# EAGLE design Volt Shield v1 (EAGLE 5.11)

## Sheet 1 of 3
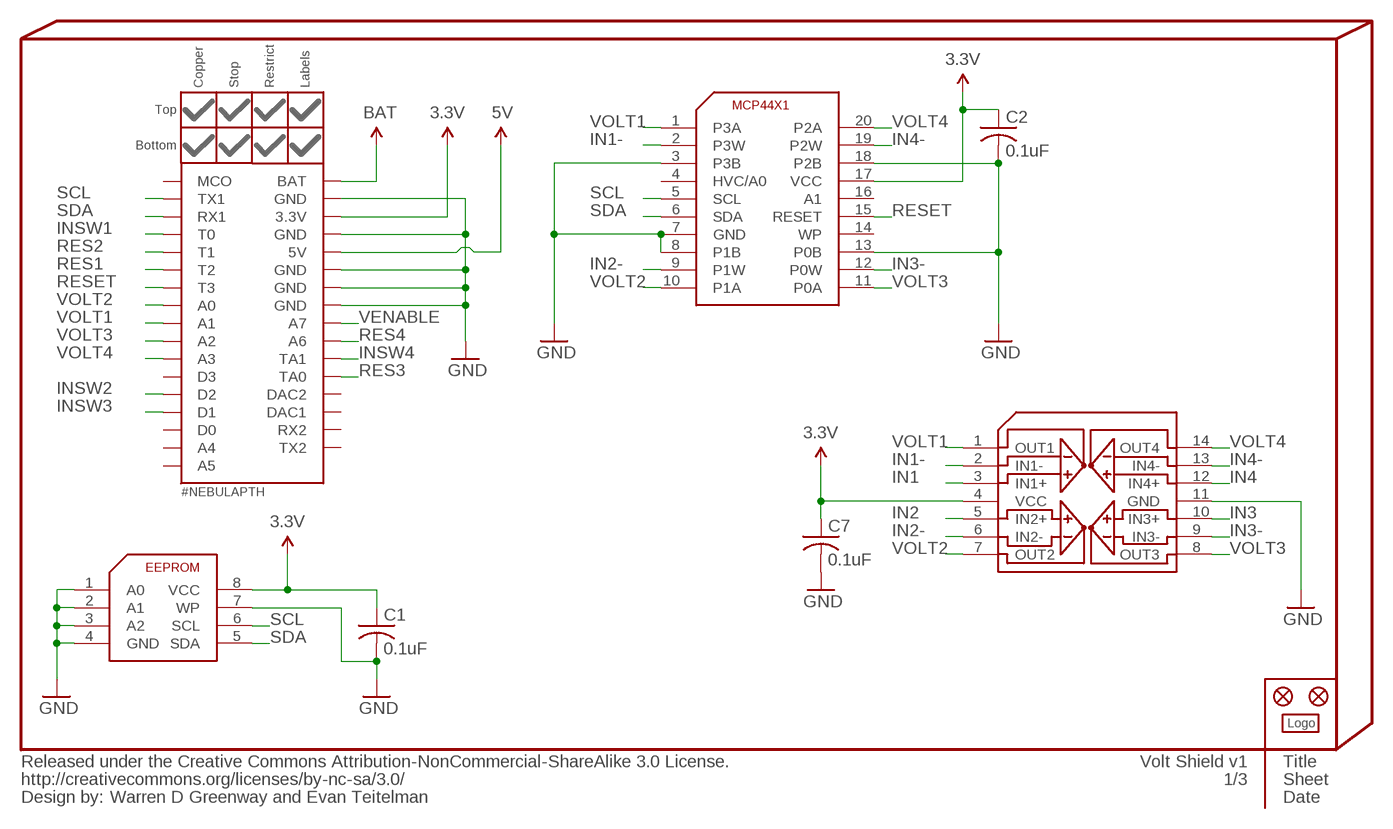
[diagram p0: schematic, sheet 1]

### Parts
C1  0.1uF  C-USC0402  [C0402]
C2  0.1uF  C-USC0402  [C0402]
C7  0.1uF  C-USC0402  [C0402]
INFO2  Warren D Greenway and Evan Teitelman  %CC-NC-SA  [%CC-NC-SA]
JP5  FIDUCIAL1X2  [FIDUCIAL-1X2]
JP6  FIDUCIAL1X2  [FIDUCIAL-1X2]
LOGO1  #PYGMYLOGONORMAL  #PYGMYLOGOLARGE  [#PYGMYLOGO]
NEBULA1  #NEBULAPTH  [#NEBULA-PTH]
NEBULAPART1  #NEBULA-PARTRESTRICT  [#NEBULA-RESTRICT]
NEBULAPART2  #NEBULA-PARTLABELS-TOP  [#NEBULA-LABELS-TOP]
NEBULAPART3  #NEBULA-PARTCOPPER  [#NEBULA-COPPER]
NEBULAPART4  #NEBULA-PARTSTOP  [#NEBULA-STOP]
U2  DIGIPOT-MCP44X1  [TSSOP20]
U3  EEPROM-ATMEL-AT24HC02B  [TSSOP8]
U8  OPAMP-ST-LMV324ID  [SO-14]

### Nets
3.3V: C1.1 C2.1 C7.1 NEBULA1.3.3V U2.17(VCC) U3.8(VCC) U8.4(VCC) ; supply symbol labelled @3.3V ; also sheet 2
5V: NEBULA1.5V ; supply symbol labelled @5V
BAT: NEBULA1.BAT ; supply symbol labelled @BAT ; also sheet 3
GND: C1.2 C2.2 C7.2 NEBULA1.GND1(GND) NEBULA1.GND2(GND) NEBULA1.GND3(GND) NEBULA1.GND4(GND) NEBULA1.GND5(GND) U2.3(P3B) U2.7(GND) U2.8(P1B) U2.13(P0B) U2.18(P2B) U3.1(A0) U3.2(A1) U3.3(A2) U3.4(GND) U3.7(WP) U8.11(GND) ; supply symbol labelled @GND ; also sheet 2,3
IN1: U8.3(IN1+) ; also sheet 2
IN1-: U2.2(P3W) U8.2(IN1-)
IN2: U8.5(IN2+) ; also sheet 2
IN2-: U2.9(P1W) U8.6(IN2-)
IN3: U8.10(IN3+) ; also sheet 2
IN3-: U2.12(P0W) U8.9(IN3-)
IN4: U8.12(IN4+) ; also sheet 2
IN4-: U2.19(P2W) U8.13(IN4-)
INSW1: NEBULA1.T0 ; also sheet 2
INSW2: NEBULA1.D2 ; also sheet 2
INSW3: NEBULA1.D1 ; also sheet 2
INSW4: NEBULA1.TA1 ; also sheet 2
RES1: NEBULA1.T2 ; also sheet 2
RES2: NEBULA1.T1 ; also sheet 2
RES3: NEBULA1.TA0 ; also sheet 2
RES4: NEBULA1.A6 ; also sheet 2
RESET: NEBULA1.T3 U2.15(RESET)
SCL: NEBULA1.COM1_TX(TX1) U2.5(SCL) U3.6(SCL)
SDA: NEBULA1.COM1_RX(RX1) U2.6(SDA) U3.5(SDA)
VENABLE: NEBULA1.A7 ; also sheet 3
VOLT1: NEBULA1.A1 U2.1(P3A) U8.1(OUT1)
VOLT2: NEBULA1.A0 U2.10(P1A) U8.7(OUT2)
VOLT3: NEBULA1.A2 U2.11(P0A) U8.8(OUT3)
VOLT4: NEBULA1.A3 U2.20(P2A) U8.14(OUT4)
Unconnected: NEBULA1.A4 NEBULA1.A5 NEBULA1.COM2_RX(RX2) NEBULA1.COM2_TX(TX2) NEBULA1.D0 NEBULA1.D3 NEBULA1.DAC1 NEBULA1.DAC2 NEBULA1.MCO U2.4(HVC/A0) U2.14(WP) U2.16(A1)

## Sheet 2 of 3
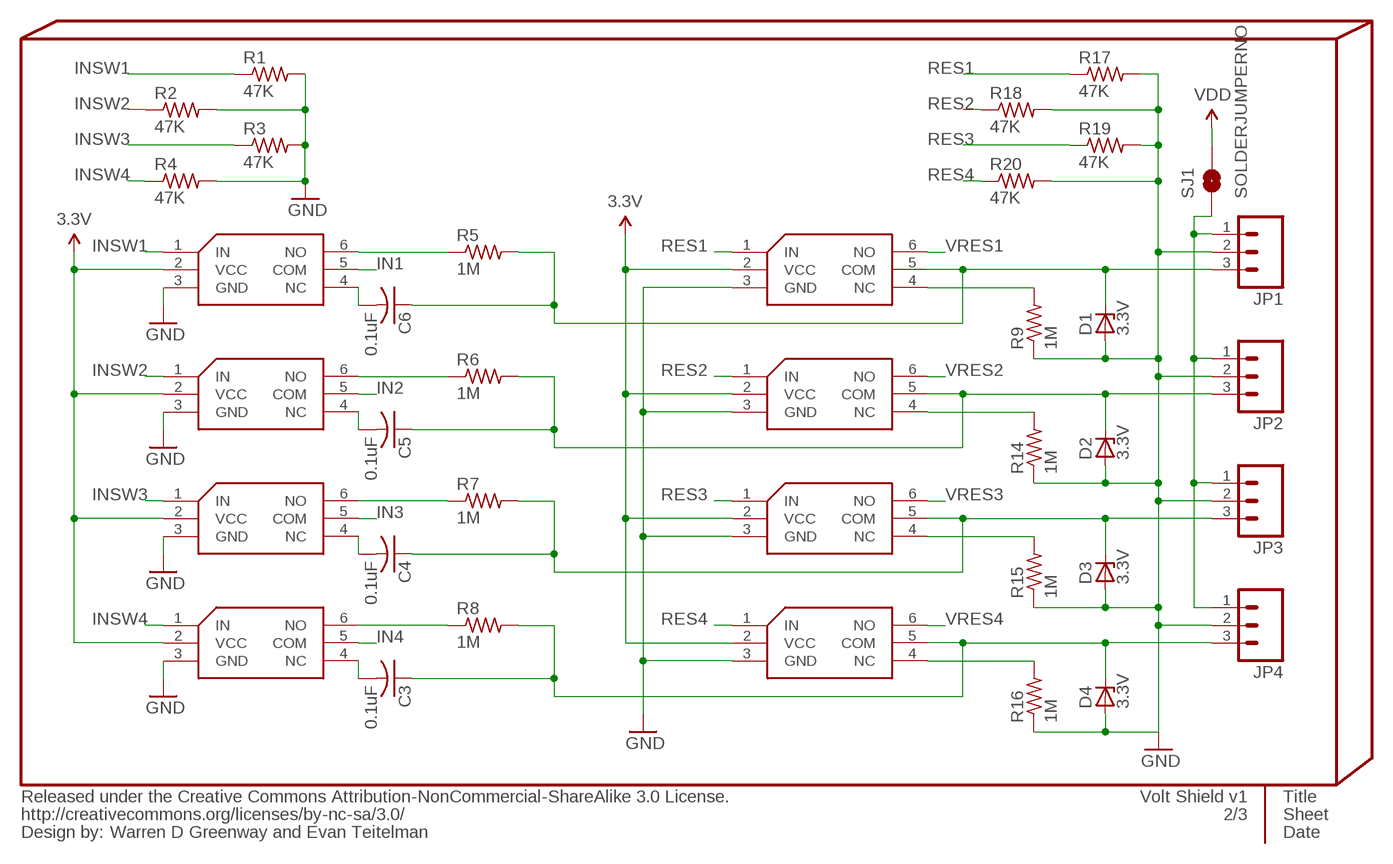
[diagram p1: schematic, sheet 2]

### Parts
C3  0.1uF  C-USC0402  [C0402]
C4  0.1uF  C-USC0402  [C0402]
C5  0.1uF  C-USC0402  [C0402]
C6  0.1uF  C-USC0402  [C0402]
D1  3.3V  ZENER-DIODESOD80C  [SOD80C]
D2  3.3V  ZENER-DIODESOD80C  [SOD80C]
D3  3.3V  ZENER-DIODESOD80C  [SOD80C]
D4  3.3V  ZENER-DIODESOD80C  [SOD80C]
JP1  M03JST-PTH  [JST-3-PTH]
JP2  M03JST-PTH  [JST-3-PTH]
JP3  M03JST-PTH  [JST-3-PTH]
JP4  M03JST-PTH  [JST-3-PTH]
R1  47K  R-US_R0402  [R0402]
R2  47K  R-US_R0402  [R0402]
R3  47K  R-US_R0402  [R0402]
R4  47K  R-US_R0402  [R0402]
R5  1M  R-US_R0402  [R0402]
R6  1M  R-US_R0402  [R0402]
R7  1M  R-US_R0402  [R0402]
R8  1M  R-US_R0402  [R0402]
R9  1M  R-US_R0402  [R0402]
R14  1M  R-US_R0402  [R0402]
R15  1M  R-US_R0402  [R0402]
R16  1M  R-US_R0402  [R0402]
R17  47K  R-US_R0402  [R0402]
R18  47K  R-US_R0402  [R0402]
R19  47K  R-US_R0402  [R0402]
R20  47K  R-US_R0402  [R0402]
SJ1  SOLDERJUMPERNO  [SJ_2S-NO]
U4  MULTIPLEXER-TI-TS5A4624  [SC70-6L]
U5  MULTIPLEXER-TI-TS5A4624  [SC70-6L]
U6  MULTIPLEXER-TI-TS5A4624  [SC70-6L]
U7  MULTIPLEXER-TI-TS5A4624  [SC70-6L]
U9  MULTIPLEXER-TI-TS5A4624  [SC70-6L]
U10  MULTIPLEXER-TI-TS5A4624  [SC70-6L]
U11  MULTIPLEXER-TI-TS5A4624  [SC70-6L]
U12  MULTIPLEXER-TI-TS5A4624  [SC70-6L]

### Nets
3.3V: U4.2(VCC) U5.2(VCC) U6.2(VCC) U7.2(VCC) U9.2(VCC) U10.2(VCC) U11.2(VCC) U12.2(VCC) ; supply symbol labelled @3.3V ; also sheet 1
GND: D1.A D2.A D3.A D4.A JP1.2 JP2.2 JP3.2 JP4.2 R1.2 R2.2 R3.2 R4.2 R9.1 R14.1 R15.1 R16.1 R17.2 R18.2 R19.2 R20.2 U4.3(GND) U5.3(GND) U6.3(GND) U7.3(GND) U9.3(GND) U10.3(GND) U11.3(GND) U12.3(GND) ; supply symbol labelled @GND ; also sheet 1,3
IN1: U4.5(COM) ; also sheet 1
IN2: U5.5(COM) ; also sheet 1
IN3: U6.5(COM) ; also sheet 1
IN4: U7.5(COM) ; also sheet 1
INSW1: R1.1 U4.1(IN) ; also sheet 1
INSW2: R2.1 U5.1(IN) ; also sheet 1
INSW3: R3.1 U6.1(IN) ; also sheet 1
INSW4: R4.1 U7.1(IN) ; also sheet 1
N$1: R5.1 U4.6(NO)
N$2: R6.1 U5.6(NO)
N$3: R7.1 U6.6(NO)
N$4: R8.1 U7.6(NO)
N$5: C3.2 U7.4(NC)
N$6: C4.2 U6.4(NC)
N$7: C6.1 D1.C JP1.3 R5.2 U9.5(COM)
N$8: JP1.1 JP2.1 JP3.1 JP4.1 SJ1.1
N$9: C5.1 D2.C JP2.3 R6.2 U10.5(COM)
N$12: C5.2 U5.4(NC)
N$13: C6.2 U4.4(NC)
N$16: C4.1 D3.C JP3.3 R7.2 U11.5(COM)
N$18: R16.2 U12.4(NC)
N$19: R15.2 U11.4(NC)
N$20: R14.2 U10.4(NC)
N$21: R9.2 U9.4(NC)
N$22: C3.1 D4.C JP4.3 R8.2 U12.5(COM)
RES1: R17.1 U9.1(IN) ; also sheet 1
RES2: R18.1 U10.1(IN) ; also sheet 1
RES3: R19.1 U11.1(IN) ; also sheet 1
RES4: R20.1 U12.1(IN) ; also sheet 1
VDD: SJ1.2 ; supply symbol labelled @VDD ; also sheet 3
VRES1: U9.6(NO) ; also sheet 3
VRES2: U10.6(NO) ; also sheet 3
VRES3: U11.6(NO) ; also sheet 3
VRES4: U12.6(NO) ; also sheet 3

## Sheet 3 of 3
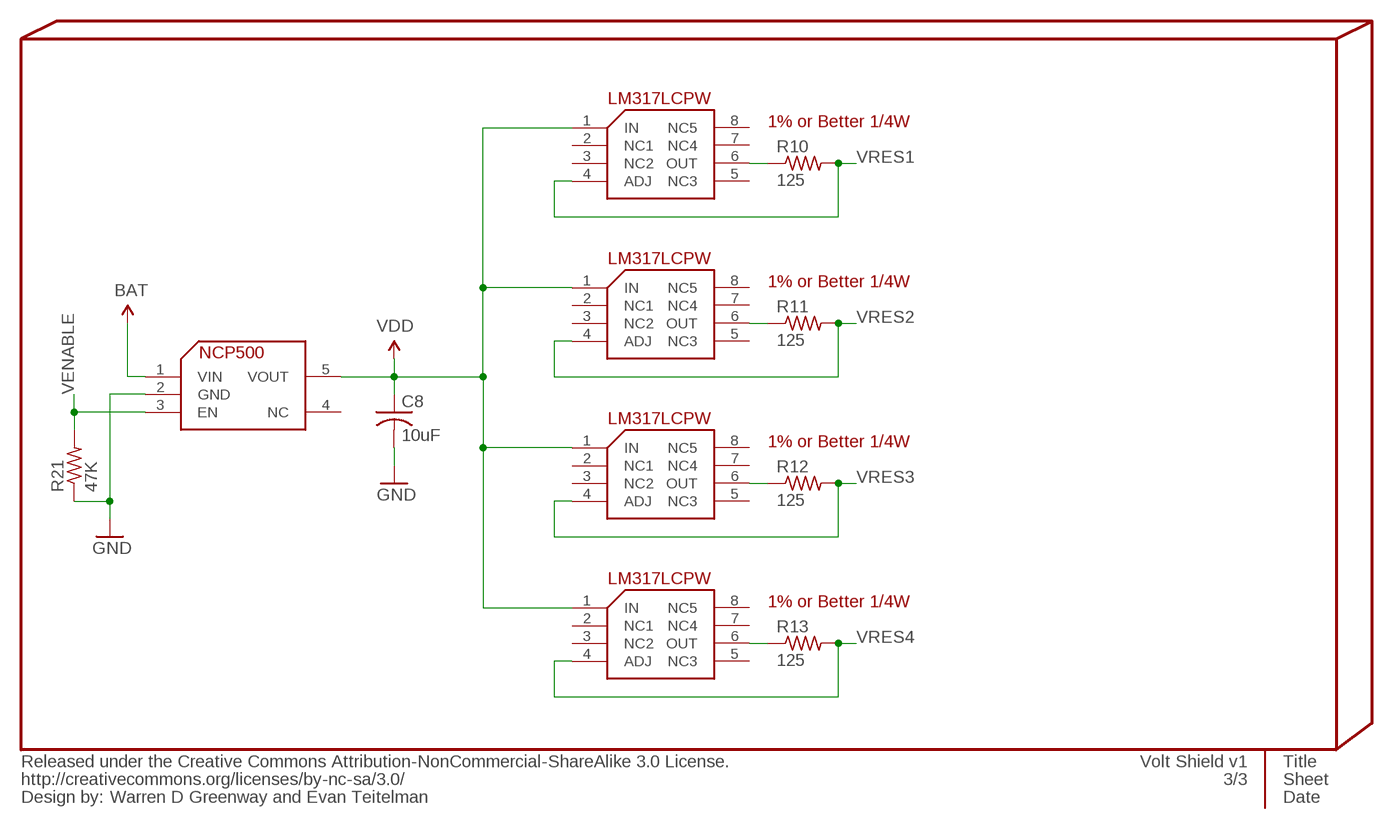
[diagram p2: schematic, sheet 3]

### Parts
C8  10uF  C-USC0805  [C0805]
R10  125  R-US_R1206  [R1206]
R11  125  R-US_R1206  [R1206]
R12  125  R-US_R1206  [R1206]
R13  125  R-US_R1206  [R1206]
R21  47K  R-US_R0402  [R0402]
U13  NCP500  [SOT23-5L]
U14  REGULATOR-TI-LM317LCPW  [TSSOP8]
U15  REGULATOR-TI-LM317LCPW  [TSSOP8]
U16  REGULATOR-TI-LM317LCPW  [TSSOP8]
U17  REGULATOR-TI-LM317LCPW  [TSSOP8]

### Nets
BAT: U13.1(VIN) ; supply symbol labelled @BAT ; also sheet 1
GND: C8.2 R21.1 U13.2(GND) ; supply symbol labelled @GND ; also sheet 1,2
N$10: R10.1 U14.6(OUT)
N$11: R11.1 U15.6(OUT)
N$14: R12.1 U16.6(OUT)
N$15: R13.1 U17.6(OUT)
VDD: C8.1 U13.5(VOUT) U14.1(IN) U15.1(IN) U16.1(IN) U17.1(IN) ; supply symbol labelled @VDD ; also sheet 2
VENABLE: R21.2 U13.3(EN) ; also sheet 1
VRES1: R10.2 U14.4(ADJ) ; also sheet 2
VRES2: R11.2 U15.4(ADJ) ; also sheet 2
VRES3: R12.2 U16.4(ADJ) ; also sheet 2
VRES4: R13.2 U17.4(ADJ) ; also sheet 2
Unconnected: U13.4(NC) U14.2(NC1) U14.3(NC2) U14.5(NC3) U14.7(NC4) U14.8(NC5) U15.2(NC1) U15.3(NC2) U15.5(NC3) U15.7(NC4) U15.8(NC5) U16.2(NC1) U16.3(NC2) U16.5(NC3) U16.7(NC4) U16.8(NC5) U17.2(NC1) U17.3(NC2) U17.5(NC3) U17.7(NC4) U17.8(NC5)

### Notes on the sheet
- 1% or Better 1/4W
- 1% or Better 1/4W
- 1% or Better 1/4W
- 1% or Better 1/4W

## Library data of the parts
C1-C8 = rcl:C-US: CAPACITOR, American symbol
D1-D4 = diode:ZENER-DIODE: Z-Diode
INFO2 = PygmyBoards:%CC-NC-SA: Released under the Creative Commons Attribution-NonCommercial-ShareAlike 3.0 License. http://creativecommons.org/licenses/by-sa/3.0 Design by: [Designer Name] Change this part's value to change the designer name
JP1-JP4 = Pygmy:M03: Header 3 Standard 3-pin 0.1" header. Use with straight break away headers (SKU : PRT-00116), right angle break away headers (PRT-00553), swiss pins (PRT-00743), machine pins (PRT-00117), and female headers (PRT-00115). Molex polarized connector foot print use with SKU : PRT-08232 with associated crimp pins and housings.
JP5 JP6 = SparkFun:FIDUCIAL: Fiducial Alignment Points Various fiducial points for machine vision alignment.
LOGO1 = Pygmy:#PYGMYLOGO
NEBULA1 = PygmyBoards:#NEBULA: Nebula Board and Shield Footprint Pads This is the only absolutely required part for the footprint. The parts in "#NEBULA-PART" are merely aesthetic. A circular board outline should be .001" thick and 1.005" in diameter (Reference circle on the Document (48) layer provided).
NEBULAPART1-NEBULAPART4 = PygmyBoards:#NEBULA-PART: Nebula Board and Shield Footprint Parts These parts are only functional when combined with the pads in "#NEBULA".
R1-R21 = rcl:R-US_: RESISTOR, American symbol
SJ1 = Pygmy:SOLDERJUMPER: Solder Jumper Standard SMD solder jumper. Used to automate production. Two varients : Normally Open and Normally Closed are the same, but have different paste layers. NC will have a large amount of paste and should jumper during reflow.
U2 = Pygmy:DIGIPOT-MCP44X1
U3 = Pygmy:EEPROM-ATMEL-AT24HC02B
U4-U7 U9-U12 = Pygmy:MULTIPLEXER-TI-TS5A4624
U8 = Pygmy:OPAMP-ST-LMV324ID
U13 = Pygmy:NCP500
U14-U17 = Pygmy:REGULATOR-TI-LM317LCPW

## Board
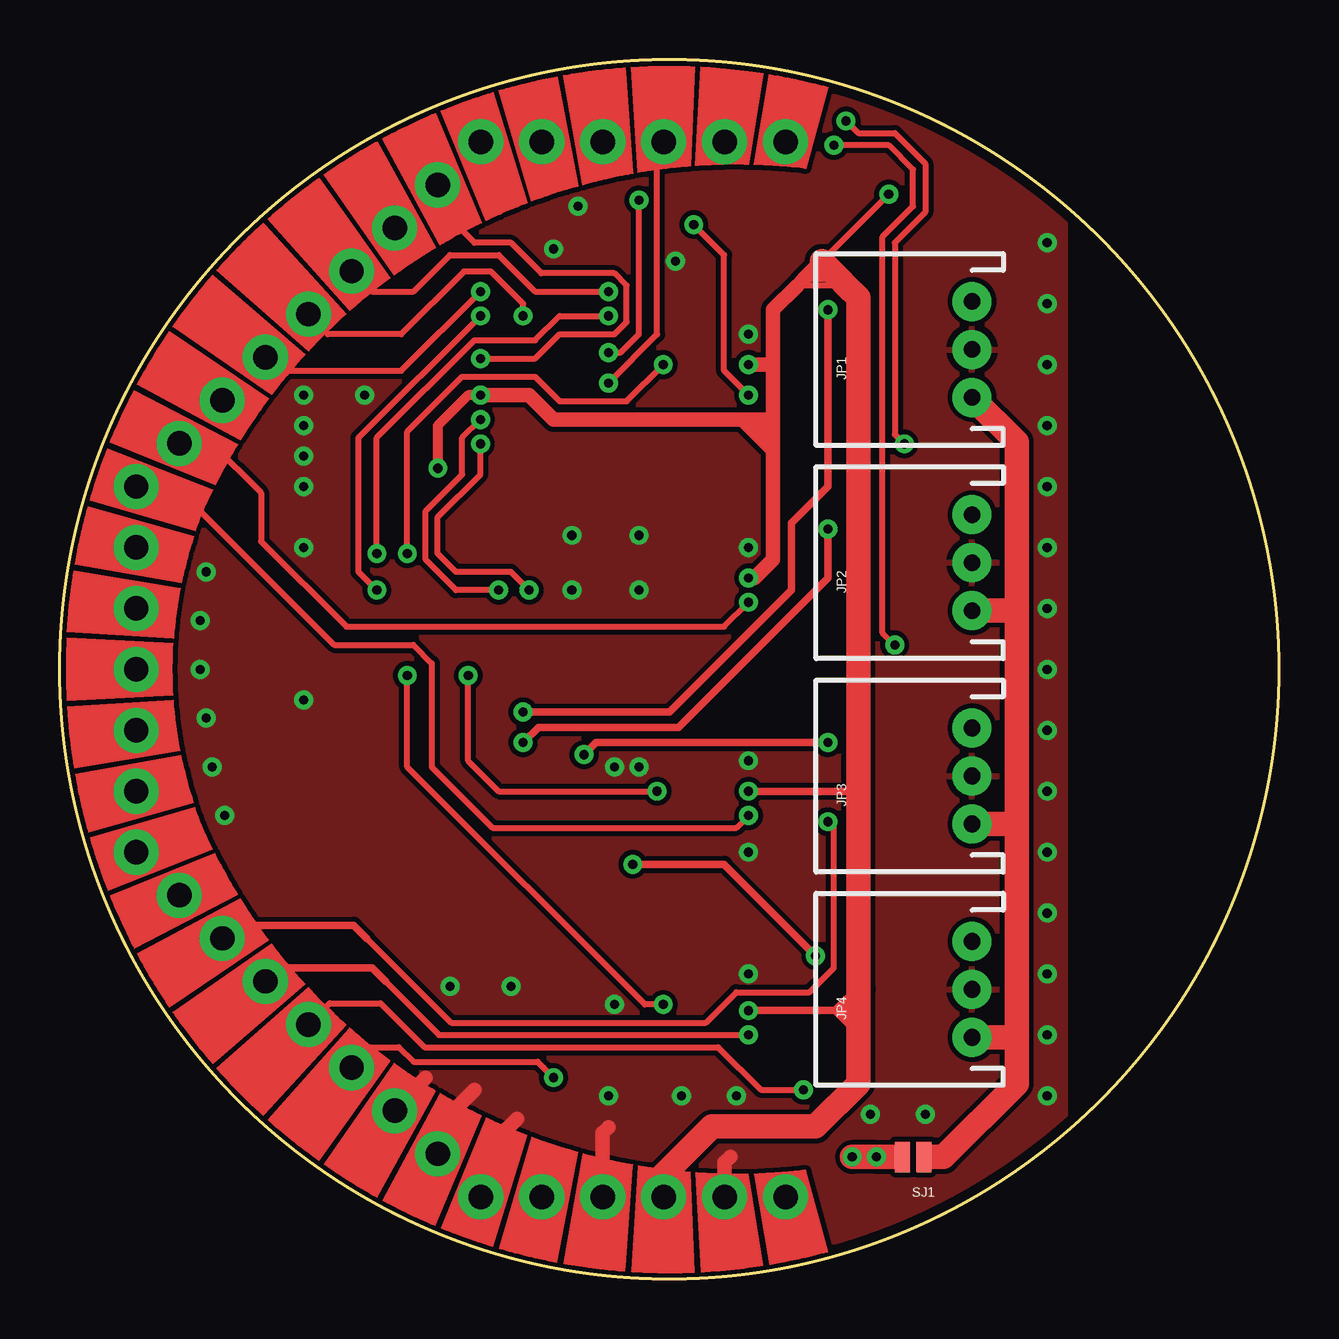
[diagram p3: board, top side]
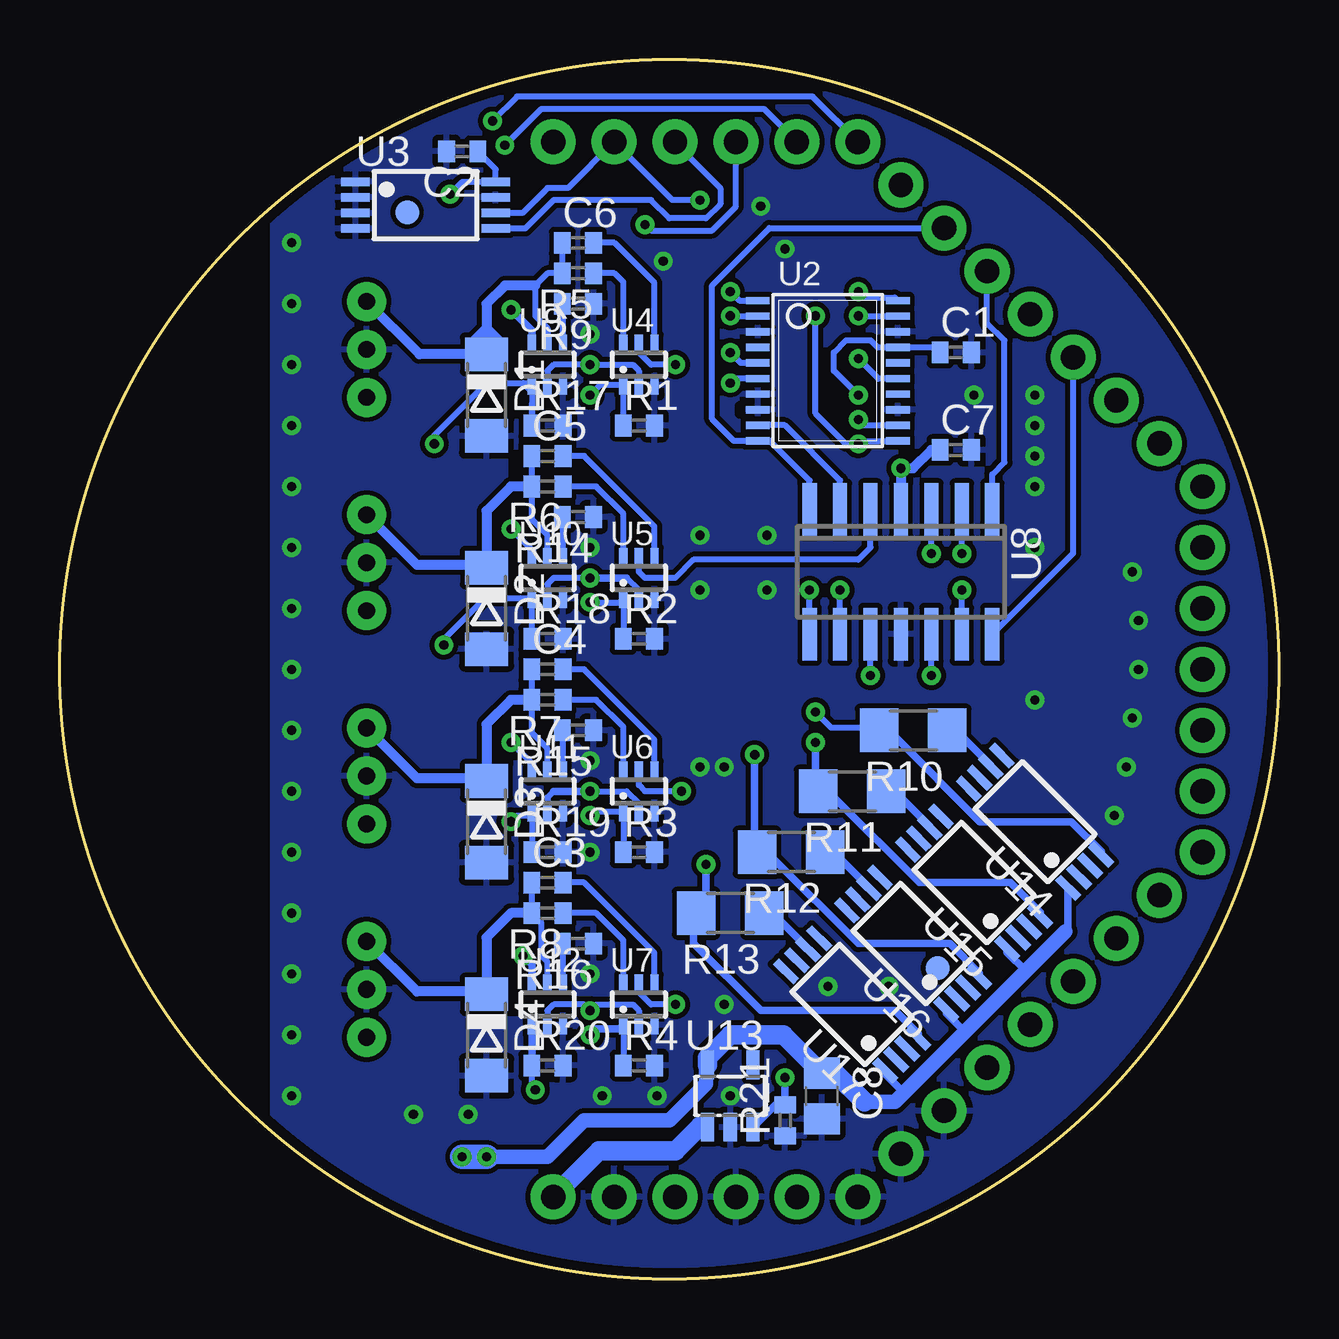
[diagram p4: board, bottom side, seen from below]

Size 50.8 x 50.8 mm. Coordinates in mm from the lower left corner, seen from the top.
Outline: circle at 25.4,25.4 radius 25.4
Copper layers (1*16): Top 0.035mm / dielectric 1.5mm / Bottom 0.035mm
Design rules "PDX (Production)": minimum track width 6mil, minimum drill 15mil, track to track 6mil, track to pad 6mil, pad to pad 4mil, via to via 6mil, smd to smd 4mil, copper to edge 15mil, drill to drill 6mil, minimum pad ring 10mil, minimum via ring 8mil, stop-mask expansion 4mil, vias tented up to drill 25mil, thermal gap 10mil
bRestrict: 16 lines

### Footprints (pad centres in the part's own frame; a part is rotated, then mirrored left to right if it is on the bottom)
C0402 = smd 0.7 x 0.9: 1 -0.65,0; 2 0.65,0
C0805 = smd 1.3 x 1.5: 1 -0.95,0; 2 0.95,0
SOD80C = smd 1.4 x 1.8: A 1.7,0; C -1.7,0
JST-3-PTH = drill 0.7 pad 1.626 round: 1 -2,-5; 2 0,-5; 3 2,-5
FIDUCIAL-1X2 = smd 1 x 1: 1 0,0
#NEBULA-PTH@1 = drill 1.016 pad 1.88 round: 3.3V -25.637,-47.388; 5V -30.716,-47.388; A0 -36.848,-7.004; A1 -38.645,-8.8; A2 -40.44,-10.596; A3 -42.237,-12.392; A4 -47.625,-22.86; A5 -47.625,-25.4; A6 -40.44,-40.204; A7 -38.645,-42; BAT -20.557,-47.388; COM1_RX -25.636,-3.412; COM1_TX -23.096,-3.412; COM2_RX -47.625,-30.48; COM2_TX -47.625,-27.94; D0 -47.625,-20.32; D1 -47.625,-17.78; D2 -45.829,-15.984; D3 -44.032,-14.188; DAC1 -47.625,-33.02; DAC2 -45.829,-34.816; GND1 -36.848,-43.796; GND2 -35.052,-45.592; GND3 -33.256,-47.388; GND4 -28.177,-47.388; GND5 -23.097,-47.388; MCO -20.556,-3.412; T0 -28.176,-3.412; T1 -30.716,-3.412; T2 -33.256,-3.412; T3 -35.052,-5.208; TA0 -44.032,-36.612; TA1 -42.237,-38.408
R0402 = smd 0.7 x 0.9: 1 -0.65,0; 2 0.65,0
R1206 = smd 1.6 x 1.803: 1 -1.422,0; 2 1.422,0
SJ_2S-NO = smd 0.635 x 1.27: 1 -0.45,0; 2 0.45,0
TSSOP20 = smd 0.305 x 0.991: 1 -2.925,-2.918; 2 -2.275,-2.918; 3 -1.625,-2.918; 4 -0.975,-2.918; 5 -0.325,-2.918; 6 0.325,-2.918; 7 0.975,-2.918; 8 1.625,-2.918; 9 2.275,-2.918; 10 2.925,-2.918; 11 2.925,2.918; 12 2.275,2.918; 13 1.625,2.918; 14 0.975,2.918; 15 0.325,2.918; 16 -0.325,2.918; 17 -0.975,2.918; 18 -1.625,2.918; 19 -2.275,2.918; 20 -2.925,2.918
TSSOP8 = smd 1.2 x 0.35: 1 -2.925,0.975; 2 -2.925,0.325; 3 -2.925,-0.325; 4 -2.925,-0.975; 5 2.925,-0.975; 6 2.925,-0.325; 7 2.925,0.325; 8 2.925,0.975
SC70-6L = smd 0.35 x 0.8: 1 -0.65,-0.85; 2 0,-0.85; 3 0.65,-0.85; 4 0.65,0.85; 5 0,0.85; 6 -0.65,0.85
SO-14 = smd 0.6 x 2.2: 1 -3.81,-2.6; 2 -2.54,-2.6; 3 -1.27,-2.6; 4 0,-2.6; 5 1.27,-2.6; 6 2.54,-2.6; 7 3.81,-2.6; 8 3.81,2.6; 9 2.54,2.6; 10 1.27,2.6; 11 0,2.6; 12 -1.27,2.6; 13 -2.54,2.6; 14 -3.81,2.6
SOT23-5L = smd 0.55 x 1.2: 1 -0.95,-1.3; 2 0,-1.3; 3 0.95,-1.3; 4 0.95,1.3; 5 -0.95,1.3

### Placement (x,y rotation side)
C1  13.46,38.61 0 bottom
C2  34.04,46.99 180 bottom
C3  30.48,16.51 0 bottom
C4  30.48,25.4 0 bottom
C5  30.48,34.29 0 bottom
C6  29.21,43.18 0 bottom
C7  13.46,34.54 0 bottom
C8  19.05,7.62 270 bottom
D1  33.02,36.83 270 bottom
D2  33.02,27.94 270 bottom
D3  33.02,19.05 270 bottom
D4  33.02,10.16 270 bottom
INFO2  -2.54,-10.16 0 top  (outside the outline)
JP1  33.02,38.73 90 top
JP2  33.02,29.84 90 top
JP3  33.02,20.95 90 top
JP4  33.02,12.06 90 top
JP5  14.22,12.95 0 bottom
JP6  36.32,44.45 0 bottom
LOGO1  19.68,25.4 0 top
NEBULA1  #NEBULAPTH  [#NEBULA-PTH@1]  50.8,50.8 0 top
NEBULAPART1  50.8,50.8 0 top
NEBULAPART2  50.8,50.8 0 top
NEBULAPART3  50.8,50.8 0 top
NEBULAPART4  50.8,50.8 0 top
R1  26.67,35.56 0 bottom
R2  26.67,26.67 0 bottom
R3  26.67,17.78 0 bottom
R4  26.67,8.89 0 bottom
R5  29.21,41.91 180 bottom
R6  30.48,33.02 180 bottom
R7  30.48,24.13 180 bottom
R8  30.48,15.24 180 bottom
R9  29.21,40.64 180 bottom
R10  15.24,22.86 180 bottom
R11  17.78,20.32 180 bottom
R12  20.32,17.78 180 bottom
R13  22.86,15.24 180 bottom
R14  29.21,31.75 180 bottom
R15  29.21,22.86 180 bottom
R16  29.21,13.97 180 bottom
R17  30.48,35.56 0 bottom
R18  30.48,26.67 0 bottom
R19  30.48,17.78 0 bottom
R20  30.48,8.89 0 bottom
R21  20.57,6.6 90 bottom
SJ1  35.56,5.08 180 top
U2  18.8,37.85 270 bottom
U3  35.56,44.75 0 bottom
U4  26.67,38.1 0 bottom
U5  26.67,29.21 0 bottom
U6  26.67,20.32 0 bottom
U7  26.67,11.43 0 bottom
U8  15.75,29.46 180 bottom
U9  30.48,38.1 0 bottom
U10  30.48,29.21 0 bottom
U11  30.48,20.32 0 bottom
U12  30.48,11.43 0 bottom
U13  22.86,7.62 0 bottom
U14  10.16,19.05 135 bottom
U15  12.7,16.51 135 bottom
U16  15.24,13.97 135 bottom
U17  17.78,11.43 135 bottom

### Tracks (layer width: path | path; a pad name or v marks a point on that pad's centre or on a via)
3.3V  (via drill 0.38)
  Top 0.254: 31.75,42.42 v34.54,45.21 | NEBULA1.3.3V 25.15,3.43 | 33.27,12.19 32.26,11.18 33.27,10.16 | 33.27,10.41 32.51,11.18 33.27,11.94 | 32.77,41.4 30.73,41.4 | 32.51,41.66 30.99,41.66 | 32.26,41.91 31.24,41.91
  Top 0.305: 33.27,11.18 32.51,11.18 32.26,11.18 v28.7,11.18 | 33.27,20.32 v28.7,20.32
  Top 0.406: v17.53,36.83 17.02,36.83 15.75,35.56 v15.75,33.78
  Top 0.61: 29.72,38.1 v28.7,38.1 | 29.72,38.1 29.72,40.39 30.73,41.4 30.99,41.66 31.24,41.91 31.75,42.42 | v17.53,36.83 19.56,36.83 20.57,35.81 28.45,35.81 | 29.72,35.81 29.21,35.81 | 29.21,35.81 28.45,35.81 | 29.72,38.1 29.72,35.81 | v28.7,29.21 28.96,29.21 29.72,29.97 29.72,34.54 | 29.72,35.81 29.72,35.31 | 29.72,35.31 29.72,34.54 | 29.72,34.54 28.45,35.81 | 29.21,35.81 29.72,35.31
  Top 1.016: 31.75,42.42 32.26,41.91 32.51,41.66 32.77,41.4 33.27,40.89 33.27,20.32 33.27,12.19 33.27,11.94 33.27,11.18 33.27,10.41 33.27,10.16 33.27,8.13 31.5,6.35 27.18,6.35 25.16,4.33 NEBULA1.3.3V
  Bottom 0.254: C2.1 32.63,46.24 U3.8 34.04,45.72 v34.54,45.21 | U10.2 30.48,28.96 30.23,29.21 v28.7,29.21 | U5.2 26.67,28.7 27.18,29.21 | U11.2 30.48,20.07 30.23,20.32 | U6.2 26.67,19.81 27.18,20.32 v28.7,20.32 | U12.2 30.48,11.18 30.23,11.43 28.96,11.43 v28.7,11.18 28.45,11.43 26.92,11.43 26.67,11.18 U7.2 | U9.2 30.48,37.85 30.23,38.1 v28.7,38.1 26.92,38.1 26.67,37.85 U4.2 | C1.1 14.32,38.82 U2.17 16.72,38.82 17.02,39.12 18.03,39.12 18.54,38.61 18.54,37.85 v17.53,36.83 | v15.75,33.78 15.75,33.53
  Bottom 0.305: v28.7,20.32 30.23,20.32 | v28.7,29.21 27.18,29.21
  Bottom 0.406: 15.75,33.53 U8.4 | 14.12,34.55 C7.1 14.48,34.54 15.24,33.78 v15.75,33.78
BAT
  Bottom 0.254: U13.1 24.1,6.32 24.13,6.35
  Bottom 0.813: 24.13,6.35 25.15,5.33 28.32,5.33 NEBULA1.BAT
GND  (via drill 0.38)
  Top 0.61: NEBULA1.GND1 13.95,7.09 15.24,8.38 | NEBULA1.GND2 15.75,6.35 17.27,7.87 | NEBULA1.GND3 17.54,4.34 18.29,5.08 18.29,5.91 C8.2 | NEBULA1.GND4 22.62,6.08 U13.2 | NEBULA1.GND5 27.7,4.84 27.94,5.08
  other vias: 12.7,36.83 10.16,34.29 10.16,36.83 28.7,39.37 10.16,24.13 41.15,22.86 41.15,20.32 41.15,12.7 41.15,15.24 41.15,10.16 28.7,30.48 41.15,7.62 41.15,30.48 41.15,43.18 41.15,40.64 41.15,38.1 41.15,33.02 41.15,35.56 41.15,27.94 41.15,25.4 28.7,12.7 41.15,17.78 28.7,21.59 22.86,7.62 25.65,42.42 28.7,17.78 24.13,21.34 23.11,21.34 16.26,12.19 18.8,12.19 23.11,11.43 25.91,7.62 28.19,7.62 33.78,6.86 36.07,6.86 21.34,30.99 24.13,30.99 21.34,28.7 24.13,28.7 10.16,35.56 10.16,33.02 10.16,30.48 5.84,27.43 6.1,29.46 5.84,25.4 6.1,23.37 6.35,21.34 6.86,19.3 20.57,42.93 21.59,44.7
  pour Bottom (isolate 0.203): -2.54,-2.54 41.91,-2.54 41.91,53.34 -2.54,53.34
  pour Top (isolate 0.203): -1.27,-1.27 41.91,-1.27 41.91,52.07 -1.27,52.07
IN1  (via drill 0.38)
  Top 0.254: v14.48,30.23 14.48,35.31 16.76,37.59 19.81,37.59 20.83,36.58 23.62,36.58 v25.15,38.1
  Bottom 0.254: v14.48,30.23 U8.3 | U4.5 26.67,38.61 26.16,38.1 v25.15,38.1
IN1-  (via drill 0.38)
  Top 0.254: v13.21,30.23 13.21,35.05 17.27,39.12 19.81,39.12 20.83,40.13 v22.86,40.13
  Bottom 0.254: v13.21,30.23 U8.2 | v22.86,40.13 21.7,40.13 U2.2
IN2
  Bottom 0.254: U5.5 26.67,29.46 26.42,29.21 25.15,29.21 24.38,29.97 17.53,29.97 17.02,30.48 U8.5
IN2-
  Bottom 0.254: U2.9 20.58,35.57 18.29,33.27 U8.6
IN3  (via drill 0.38)
  Top 0.254: v24.89,20.32 18.29,20.32 17.02,21.59 v17.02,25.15
  Bottom 0.254: U6.5 26.67,20.57 26.42,20.32 v24.89,20.32 | v17.02,25.15 U8.10
IN3-  (via drill 0.38)
  Top 0.254: v18.29,28.7 16.51,28.7 15.24,29.97 15.24,32 16.76,33.53 16.76,35.05 v17.53,35.81
  Bottom 0.254: U2.12 17.28,35.57 v17.53,35.81 | U8.9 v18.29,28.7
IN4  (via drill 0.38)
  Top 0.254: v25.15,11.43 24.38,11.43 14.48,21.34 v14.48,25.15
  Bottom 0.254: v14.48,25.15 U8.12 | U7.5 26.67,11.94 26.16,11.43 v25.15,11.43
IN4-  (via drill 0.38)
  Top 0.254: v13.21,28.7 12.45,29.46 12.45,35.05 v17.53,40.13
  Bottom 0.254: U8.13 v13.21,28.7 | v17.53,40.13 15.89,40.13 U2.19
INSW1  (via drill 0.38)
  Top 0.254: v26.42,43.94 27.69,42.67 27.69,37.85 v28.7,36.83
  Bottom 0.254: R1.1 U4.1 28.28,37.25 v28.7,36.83 | NEBULA1.T0 22.62,44.69 23.62,43.69 26.16,43.69 v26.42,43.94
INSW2  (via drill 0.38)
  Top 0.254: v28.7,28.19 27.69,27.18 11.94,27.18 8.38,30.73 8.38,32.77 6.33,34.82 NEBULA1.D2
  Bottom 0.254: R2.1 U5.1 27.49,28.19 v28.7,28.19
INSW3  (via drill 0.38)
  Top 0.254: v28.7,19.3 28.19,18.8 18.03,18.8 15.49,21.34 15.49,25.65 14.73,26.42 11.43,26.42 4.83,33.02 NEBULA1.D1
  Bottom 0.254: R3.1 U6.1 28.54,19.47 v28.7,19.3
INSW4  (via drill 0.38)
  Top 0.254: 13.57,12.39 15.8,10.16 v28.7,10.16
  Top 0.305: 13.57,12.39 13,12.95 8.89,12.95 8.56,12.63 NEBULA1.TA1
  Bottom 0.254: U7.1 R4.1
  Bottom 0.305: v28.7,10.16 28.45,10.41 27.49,10.41 U7.1
N$1
  Bottom 0.254: U4.6 27.32,41.54 27.69,41.91 R5.1
N$2
  Bottom 0.254: U5.6 27.32,31.89 28.45,33.02 R6.1
N$3
  Bottom 0.254: U6.6 27.32,23 28.45,24.13 R7.1
N$4
  Bottom 0.254: U7.6 27.32,14.11 28.45,15.24 R8.1
N$5
  Bottom 0.254: U7.4 26.02,13.57 28.96,16.51 C3.2
N$6
  Bottom 0.254: U6.4 26.02,22.46 28.96,25.4 C4.2
N$7
  Bottom 0.254: C6.1 R5.2 30.48,41.91 30.99,41.4 30.99,40.13 30.48,39.62 U9.5
  Bottom 0.406: 30.99,41.4 32.26,41.4 33.02,40.64 33.02,39.62 | 33.02,39.62 D1.C 35.81,38.53 JP1.3 | 33.02,39.62 32.51,39.12 | 33.02,39.62 33.53,39.12
N$8
  Top 0.406: SJ1.1 36.32,5.08
  Top 1.016: 36.32,5.08 36.83,5.08 39.88,8.13 39.88,10.16 | 39.88,10.16 39.88,19.05 | 39.88,19.05 39.88,27.94 | 39.88,27.94 39.88,34.88 JP1.1 | JP2.1 39.78,27.84 39.88,27.94 | JP4.1 39.78,10.06 39.88,10.16 | JP3.1 39.78,18.95 39.88,19.05
N$9
  Bottom 0.254: C5.1 R6.2 31.13,31.64 30.48,30.99 U10.5 | 33.02,29.75 D2.C
  Bottom 0.406: R6.2 32,33.02 33.02,32 33.02,29.75 35.92,29.75 JP2.3
N$10
  Bottom 0.305: U14.6 12,21.4 13.21,22.61 13.56,22.61 R10.1
N$11
  Bottom 0.305: U15.6 14.54,18.86 15.75,20.07 16.1,20.07 R11.1
N$12
  Bottom 0.254: U5.4 26.02,31.35 28.96,34.29 C5.2
N$13
  Bottom 0.254: U4.4 26.02,41.51 27.69,43.18 C6.2
N$14
  Bottom 0.305: U16.6 17.08,16.32 18.29,17.53 18.64,17.53 R12.1
N$15
  Bottom 0.305: U17.6 19.62,13.78 20.83,14.99 21.18,14.99 R13.1
N$16
  Bottom 0.254: C4.1 R7.2 31.13,22.75 30.48,22.1 U11.5 | 33.02,20.86 D3.C
  Bottom 0.406: R7.2 32,24.13 33.02,23.11 33.02,20.86 35.92,20.86 JP3.3
N$18
  Bottom 0.254: U12.4 29.83,13.94 R16.2
N$19
  Bottom 0.254: U11.4 29.83,22.83 R15.2
N$20
  Bottom 0.254: U10.4 29.83,31.72 R14.2
N$21
  Bottom 0.254: U9.4 29.83,40.61 R9.2
N$22
  Bottom 0.254: C3.1 R8.2 30.73,14.84 30.73,13.46 30.48,13.21 U12.5 | 33.02,11.97 D4.C
  Bottom 0.406: JP4.3 35.92,11.97 33.02,11.97 33.02,14.22 32,15.24 R8.2
RES1  (via drill 0.38)
  Top 0.254: v32.77,48.26 33.27,47.75 34.8,47.75 36.07,46.48 36.07,44.45 34.8,43.18 34.8,35.19 v35.19,34.8
  Bottom 0.254: 31.13,36.46 R17.1 U9.1 31.22,37.34 31.5,37.34 | v35.19,34.8 35.19,35.16 33.02,37.34 31.5,37.34 | v32.77,48.26 31.75,49.28 19.43,49.28 NEBULA1.T2 | 31.5,37.34 31.24,37.08
RES2  (via drill 0.38)
  Top 0.254: v34.8,26.42 34.29,26.92 34.29,43.43 35.56,44.7 35.56,46.23 34.54,47.24 v32.26,47.24
  Bottom 0.254: R18.1 U10.1 33.11,28.36 34.8,26.67 v34.8,26.42 | v32.26,47.24 30.73,48.77 21.46,48.77 NEBULA1.T1
RES3  (via drill 0.38)
  Top 0.254: v32,19.05 32.26,18.8 32.26,12.95 31.24,11.94 28.19,11.94 26.92,10.67 16.31,10.67 12.79,14.19
  Top 0.305: 12.79,14.19 12.24,14.73 7.31,14.73 NEBULA1.TA0
  Bottom 0.254: R19.1 U11.1 31.3,19.3 31.75,19.3 v32,19.05
RES4  (via drill 0.38)
  Top 0.254: v30.99,7.87 29.21,7.87 27.43,9.65 15.19,9.65 13.36,11.48 11.24,11.48 NEBULA1.A6
  Bottom 0.254: R20.1 31.13,8.02 v30.99,7.87
  Bottom 0.305: R20.1 U12.1
RESET  (via drill 0.38)
  Top 0.254: v17.53,38.35 19.81,38.35 20.83,39.37 23.11,39.37 23.62,39.88 23.62,41.4 23.11,41.91 20.07,41.91 18.8,43.18 17.27,43.18 15.75,44.7 NEBULA1.T3
  Bottom 0.254: v17.53,38.35 16.69,37.52 U2.15
SCL  (via drill 0.38)
  Top 0.254: v22.86,38.61 23.37,38.61 24.13,39.37 v24.13,44.96
  Bottom 0.254: U3.6 31.52,44.42 30.48,45.47 29.63,45.47 NEBULA1.COM1_TX 25.27,44.96 v24.13,44.96 | U2.5 22.42,38.17 v22.86,38.61
SDA  (via drill 0.38)
  Top 0.254: v22.86,37.34 24.89,39.37 24.89,47.12 NEBULA1.COM1_RX
  Bottom 0.254: U3.5 31.41,43.77 30.23,44.96 26.16,44.96 25.4,44.2 23.88,44.2 23.28,44.8 23.28,45.47 25.16,47.35 NEBULA1.COM1_RX | U2.6 22.68,37.52 v22.86,37.34
VDD  (via drill 0.38)
  Top 0.406: 34.8,5.08 SJ1.2
  Top 1.016: v33.02,5.08 v34.04,5.08 34.8,5.08
  Bottom 0.305: U16.1 13.86,11.07 13.08,10.29 | U17.1 16.4,8.53 15.62,7.75 | U14.1 8.78,14.59 8.89,14.48 | U15.1 11.32,13.61 10.54,12.83
  Bottom 0.61: 17.27,7.37 16,7.37 15.62,7.75 13.08,10.29 10.54,12.83 8.89,14.48 | v34.04,5.08 30.48,5.08 28.96,6.6 25.4,6.6 23.88,8.13 23.88,8.85 U13.5
  Bottom 0.813: U13.5 23.81,9.21 22.86,10.16 20.64,10.16 C8.1 18.48,8.57 17.27,7.37
  Bottom 1.016: v34.04,5.08 v33.02,5.08
VENABLE  (via drill 0.38)
  Top 0.254: v20.57,8.38 20.16,8.8 19.91,9.04 14.73,9.04 14.12,9.65 12.9,9.65 12.15,8.9 NEBULA1.A7
  Bottom 0.305: v20.57,8.38 R21.2 20.98,7.25 U13.3
VOLT1  (via drill 0.38)
  Top 0.254: v22.86,41.15 19.81,41.15 18.29,42.67 16.26,42.67 14.73,41.15 13.01,41.15 NEBULA1.A1
  Bottom 0.254: NEBULA1.A1 12.15,39.84 11.43,39.12 11.43,34.04 11.94,33.53 U8.1 | U2.1 22.48,40.77 v22.86,41.15
VOLT2
  Bottom 0.254: U8.7 19.56,33.27 21.2,34.92 U2.10 22.71,34.92 23.62,35.84 23.62,41.4 21.23,43.8 NEBULA1.A0
VOLT3  (via drill 0.38)
  Top 0.254: 17.78,34.8 v17.53,34.8 17.53,33.53 15.75,31.75 15.75,30.23 16.51,29.46 18.8,29.46 v19.56,28.7 | v19.3,40.13 19.3,40.64 17.96,41.98 16.84,41.98 14.22,39.37 11.18,39.37 10.36,40.19 NEBULA1.A2
  Bottom 0.254: U8.8 v19.56,28.7 | v19.3,40.13 19.3,36.07 18.03,34.8 v17.53,34.8 17.4,34.92 U2.11
VOLT4  (via drill 0.38)
  Top 0.254: v17.53,41.15 14.22,37.85 9.12,37.85 NEBULA1.A3
  Bottom 0.254: NEBULA1.A3 8.56,30.24 U8.14 | v17.53,41.15 17.27,40.89 16,40.89 U2.20
VRES1  (via drill 0.38)
  Top 0.305: v32,40.39 32,33.02 30.48,31.5 30.48,28.7 25.4,23.62 v19.3,23.62
  Bottom 0.254: 16.76,22.96 18.64,22.96 v19.3,23.62
  Bottom 0.305: U9.6 31.13,39.51 v32,40.39 | 16.76,22.96 R10.2 16.41,22.61 16,22.61 12.45,19.05 8.64,19.05 7.4,17.82 U14.4
VRES2  (via drill 0.38)
  Top 0.305: v32,31.24 32,29.21 25.78,22.99 19.94,22.99 v19.3,22.35
  Bottom 0.254: U10.6 31.13,30.37 v32,31.24
  Bottom 0.305: v19.3,22.35 19.3,20.42 R11.2 18.95,20.07 18.54,20.07 14.99,16.51 11.18,16.51 9.94,15.28 U15.4
VRES3  (via drill 0.38)
  Top 0.305: v32,22.35 22.35,22.35 v21.84,21.84
  Bottom 0.254: U11.6 31.13,21.48 v32,22.35
  Bottom 0.305: U16.4 12.48,12.74 13.72,13.97 17.53,13.97 21.08,17.53 21.49,17.53 R12.2 21.84,17.88 v21.84,21.84
VRES4  (via drill 0.38)
  Top 0.305: v31.5,13.46 27.69,17.27 v23.88,17.27
  Bottom 0.305: U17.4 15.02,10.2 16,11.18 21.59,11.18 24.38,13.97 24.38,15.14 R13.2 23.88,15.65 v23.88,17.27 | U12.6 31.13,13.1 v31.5,13.46

### Text on the board
tTest: S | S | S | S
bTest: Designed By: | Evan Teitelman | Warren D Greenway | Pygmy Volt Shield v1
Document: Pygmy Volt Shield | Version 1 | Standard Grid: 50mil | Routing Grids: 10mil/8mil